# Altium schematic sheet TR.SchDoc
size Letter; DocumentNumber: 6; SheetNumber: 6; SheetTotal: 8
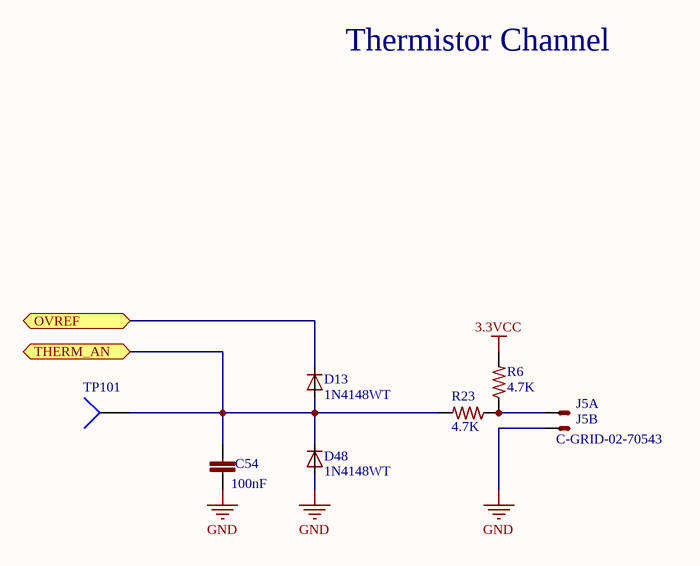
[diagram p0: TR.SchDoc]

## Parts
C54  100nF  [C0402]
D13  1N4148WT  [SOD523]
D48  1N4148WT  [SOD523]
J5  C-GRID-02-70543  [70543-02]  (value not drawn)  (parts A,B of 2)
R6  4.7K  [R0603]
R23  4.7K  [R0603]
TP101  TP4  [TP-2]  (value not drawn)

## Ports
OVREF, THERM_AN

## Nets
3.3VCC: R6.2
GND: C54.2 D48.A J5.2(S)
OVREF: D13.C ; port OVREF
THERM_AN: C54.1 D13.A D48.C R23.2 TP101.1 ; port THERM_AN
NetJ5_1: J5.1(S) R6.1 R23.1

## Notes on the sheet
- Thermistor Channel

## Library data of the parts
C54 = GRM155R71C104KA88D: CAP CER 0402 100nF 16V 10% X7R; LastRevisionNote: ImportComponents; Published: 23-Apr-2014; Publisher: UltiMachine; LastRevisionDate: 23-Apr-2014; ManufacturerPartNumber: GRM155R71C104KA88D; VALUE: 100nF
D13 D48 = 1N4148WT: DIODE SOD523; LastRevisionNote: ImportComponents; Published: 23-Apr-2014; Publisher: UltiMachine; LastRevisionDate: 23-Apr-2014; Value: 1N4148WT
J5 = C-GRID-02-70543: Connector 2pos; LastRevisionNote: ImportComponents; Published: 23-Apr-2014; Publisher: UltiMachine; LastRevisionDate: 23-Apr-2014
R6 R23 = ERJ3EKF4701V: RES 0603 4.7K 100mW 1%; LastRevisionNote: ImportComponents; Published: 23-Apr-2014; Publisher: UltiMachine; LastRevisionDate: 23-Apr-2014; ManufacturerPartNumber: ERJ3EKF4701V; VALUE: 4.7K
TP101 = Socket: LatestRevisionDate: 17-Jul-2002; LatestRevisionNote: Re-released for DXP Platform.; Publisher: Altium Limited